# Altium schematic sheet LED SEQUENCER.SchDoc
size A; SheetNumber: 1; SheetTotal: 1
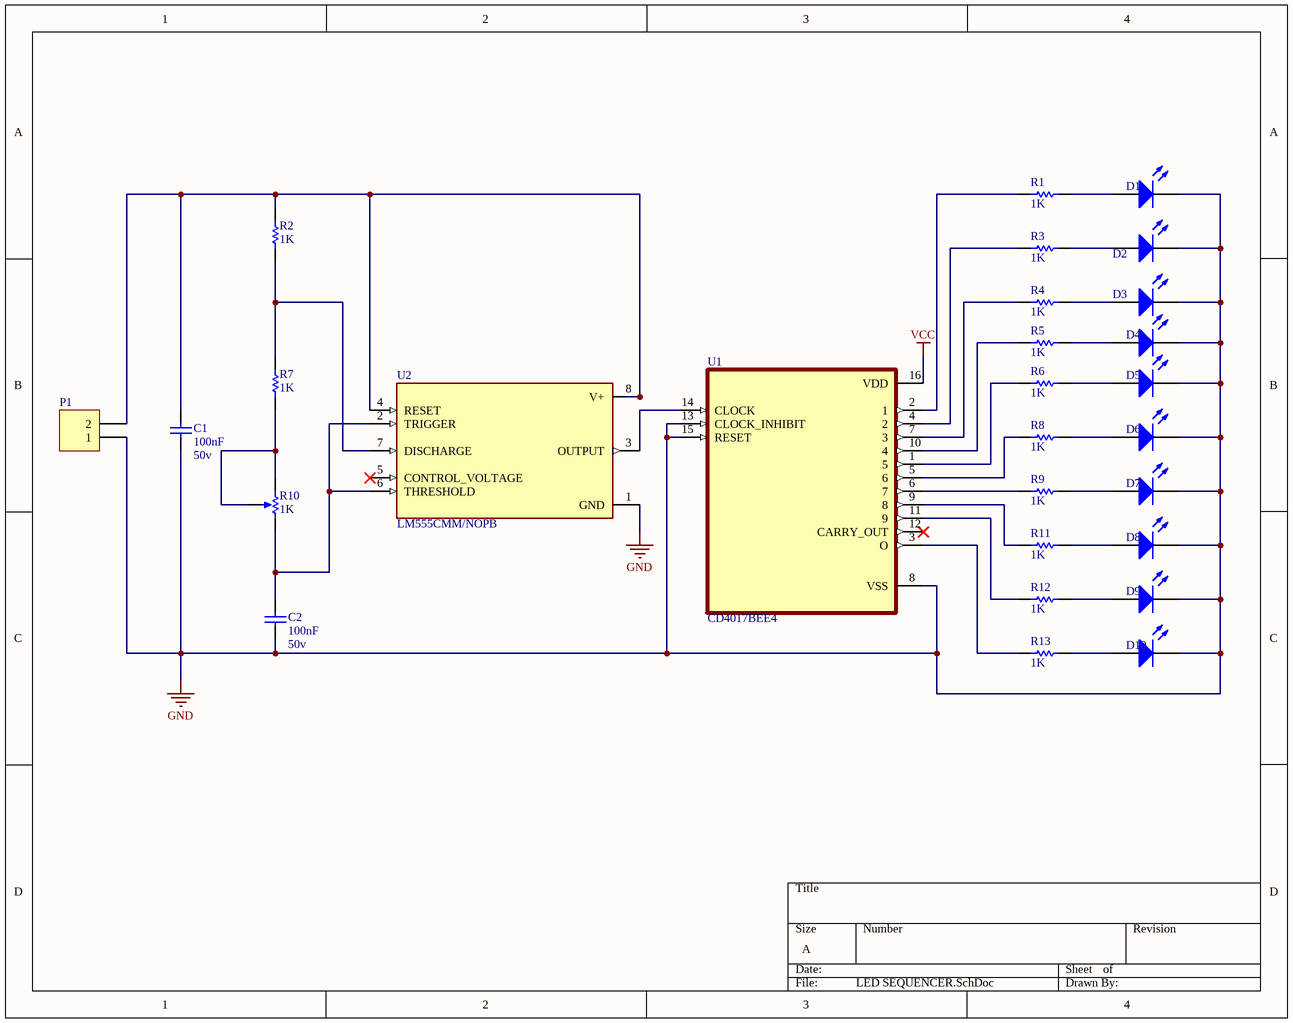
[diagram p0: LED SEQUENCER.SchDoc]

## Parts
C1  Volte: 50v  [MY_0603]  (hidden comment: 100nF)
C2  Volte: 50v  [MY_0603]  (hidden comment: 100nF)
D1  (no value)  [MY_LED_0805]
D2  (no value)  [MY_LED_0805]
D3  (no value)  [MY_LED_0805]
D4  (no value)  [MY_LED_0805]
D5  (no value)  [MY_LED_0805]
D6  (no value)  [MY_LED_0805]
D7  (no value)  [MY_LED_0805]
D8  (no value)  [MY_LED_0805]
D9  (no value)  [MY_LED_0805]
D10  (no value)  [MY_LED_0805]
P1  Header 2  [MY_FE02]  (value not drawn)
R1  1K  [MY_0603]
R2  1K  [MY_0603]
R3  1K  [MY_0603]
R4  1K  [MY_0603]
R5  1K  [MY_0603]
R6  1K  [MY_0603]
R7  1K  [MY_0603]
R8  1K  [MY_0603]
R9  1K  [MY_0603]
R10  1K  [My_Pot]
R11  1K  [MY_0603]
R12  1K  [MY_0603]
R13  1K  [MY_0603]
U1  CD4017BEE4  [DIP794W45P254L1969H508Q16]
U2  LM555CMM/NOPB  [SOP65P490X110-8N]

## Nets
GND: C1.1 C2.1 D1.K D2.K D3.K D4.K D5.K D6.K D7.K D8.K D9.K D10.K P1.1 U1.8(VSS) U1.13(CLOCK_INHIBIT) U1.15(RESET) U2.1(GND)
VCC: U1.16(VDD)
NetC1_2: C1.2 P1.2 R2.1 U2.4(RESET) U2.8(V+)
NetC2_2: C2.2 R10.2(BOT) U2.2(TRIGGER) U2.6(THRESHOLD)
NetD1_A: D1.A R1.2
NetD2_A: D2.A R3.2
NetD3_A: D3.A R4.2
NetD4_A: D4.A R5.2
NetD5_A: D5.A R6.2
NetD6_A: D6.A R8.2
NetD7_A: D7.A R9.2
NetD8_A: D8.A R11.2
NetD9_A: D9.A R12.2
NetD10_A: D10.A R13.2
NetR1_1: R1.1 U1.2(1)
NetR2_2: R2.2 R7.1 U2.7(DISCHARGE)
NetR3_1: R3.1 U1.4(2)
NetR4_1: R4.1 U1.7(3)
NetR5_1: R5.1 U1.10(4)
NetR6_1: R6.1 U1.1(5)
NetR7_2: R7.2 R10.1(TOP) R10.3(TAP)
NetR8_1: R8.1 U1.5(6)
NetR9_1: R9.1 U1.6(7)
NetR11_1: R11.1 U1.9(8)
NetR12_1: R12.1 U1.11(9)
NetR13_1: R13.1 U1.3(O)
NetU1_14: U1.14(CLOCK) U2.3(OUTPUT)

Not connected (* = marked no-connect by the designer): U1 12(CARRY_OUT)*; U2 5(CONTROL_VOLTAGE)*

## Library data of the parts
C1 C2 = Cap ceramic: None polar capacitor; ASiD Part Number: C-AS; Value: 100nF
D1-D10 = LED: Typical INFRARED GaAs LED; ASiD Part Number: LED-AS
P1 = Header 2: Header, 2-Pin; ASiD Part Number: Header 2-AS
R1-R9 R11-R13 = Res: Standard resistor; ASiD Part Number: Res-AS; Value: 1K
R10 = Variable Resistor: Potentiometer; ASiD Part Number: Variable Resistor-AS; Value: 1K
U1 = CD4017BEE4: CMOS Decade Counter with 10 Decoded Outputs 16-PDIP -55 to 125; MF: Texas Instruments; SnapEDA_Link: https://www.snapeda.com/parts/CD4017BEE4/Texas+Instruments/view-part/?ref=snap; Package: PDIP-16 Texas Instruments; Value: *; MP: CD4017BEE4; Check_prices: https://www.snapeda.com/parts/CD4017BEE4/Texas+Instruments/view-part/?ref=eda
U2 = LM555CMM/NOPB: Highly Stable 555 Timer; MF: Texas Instruments; SnapEDA_Link: https://www.snapeda.com/parts/LM555CMM/NOPB/Texas+Instruments/view-part/?ref=snap; Package: VSSOP-8 Texas Instruments; Value: *; MP: LM555CMM/NOPB; Check_prices: https://www.snapeda.com/parts/LM555CMM/NOPB/Texas+Instruments/view-part/?ref=eda